# EAGLE design H15R00 (EAGLE 9.3.0)

## Sheet 1 of 2
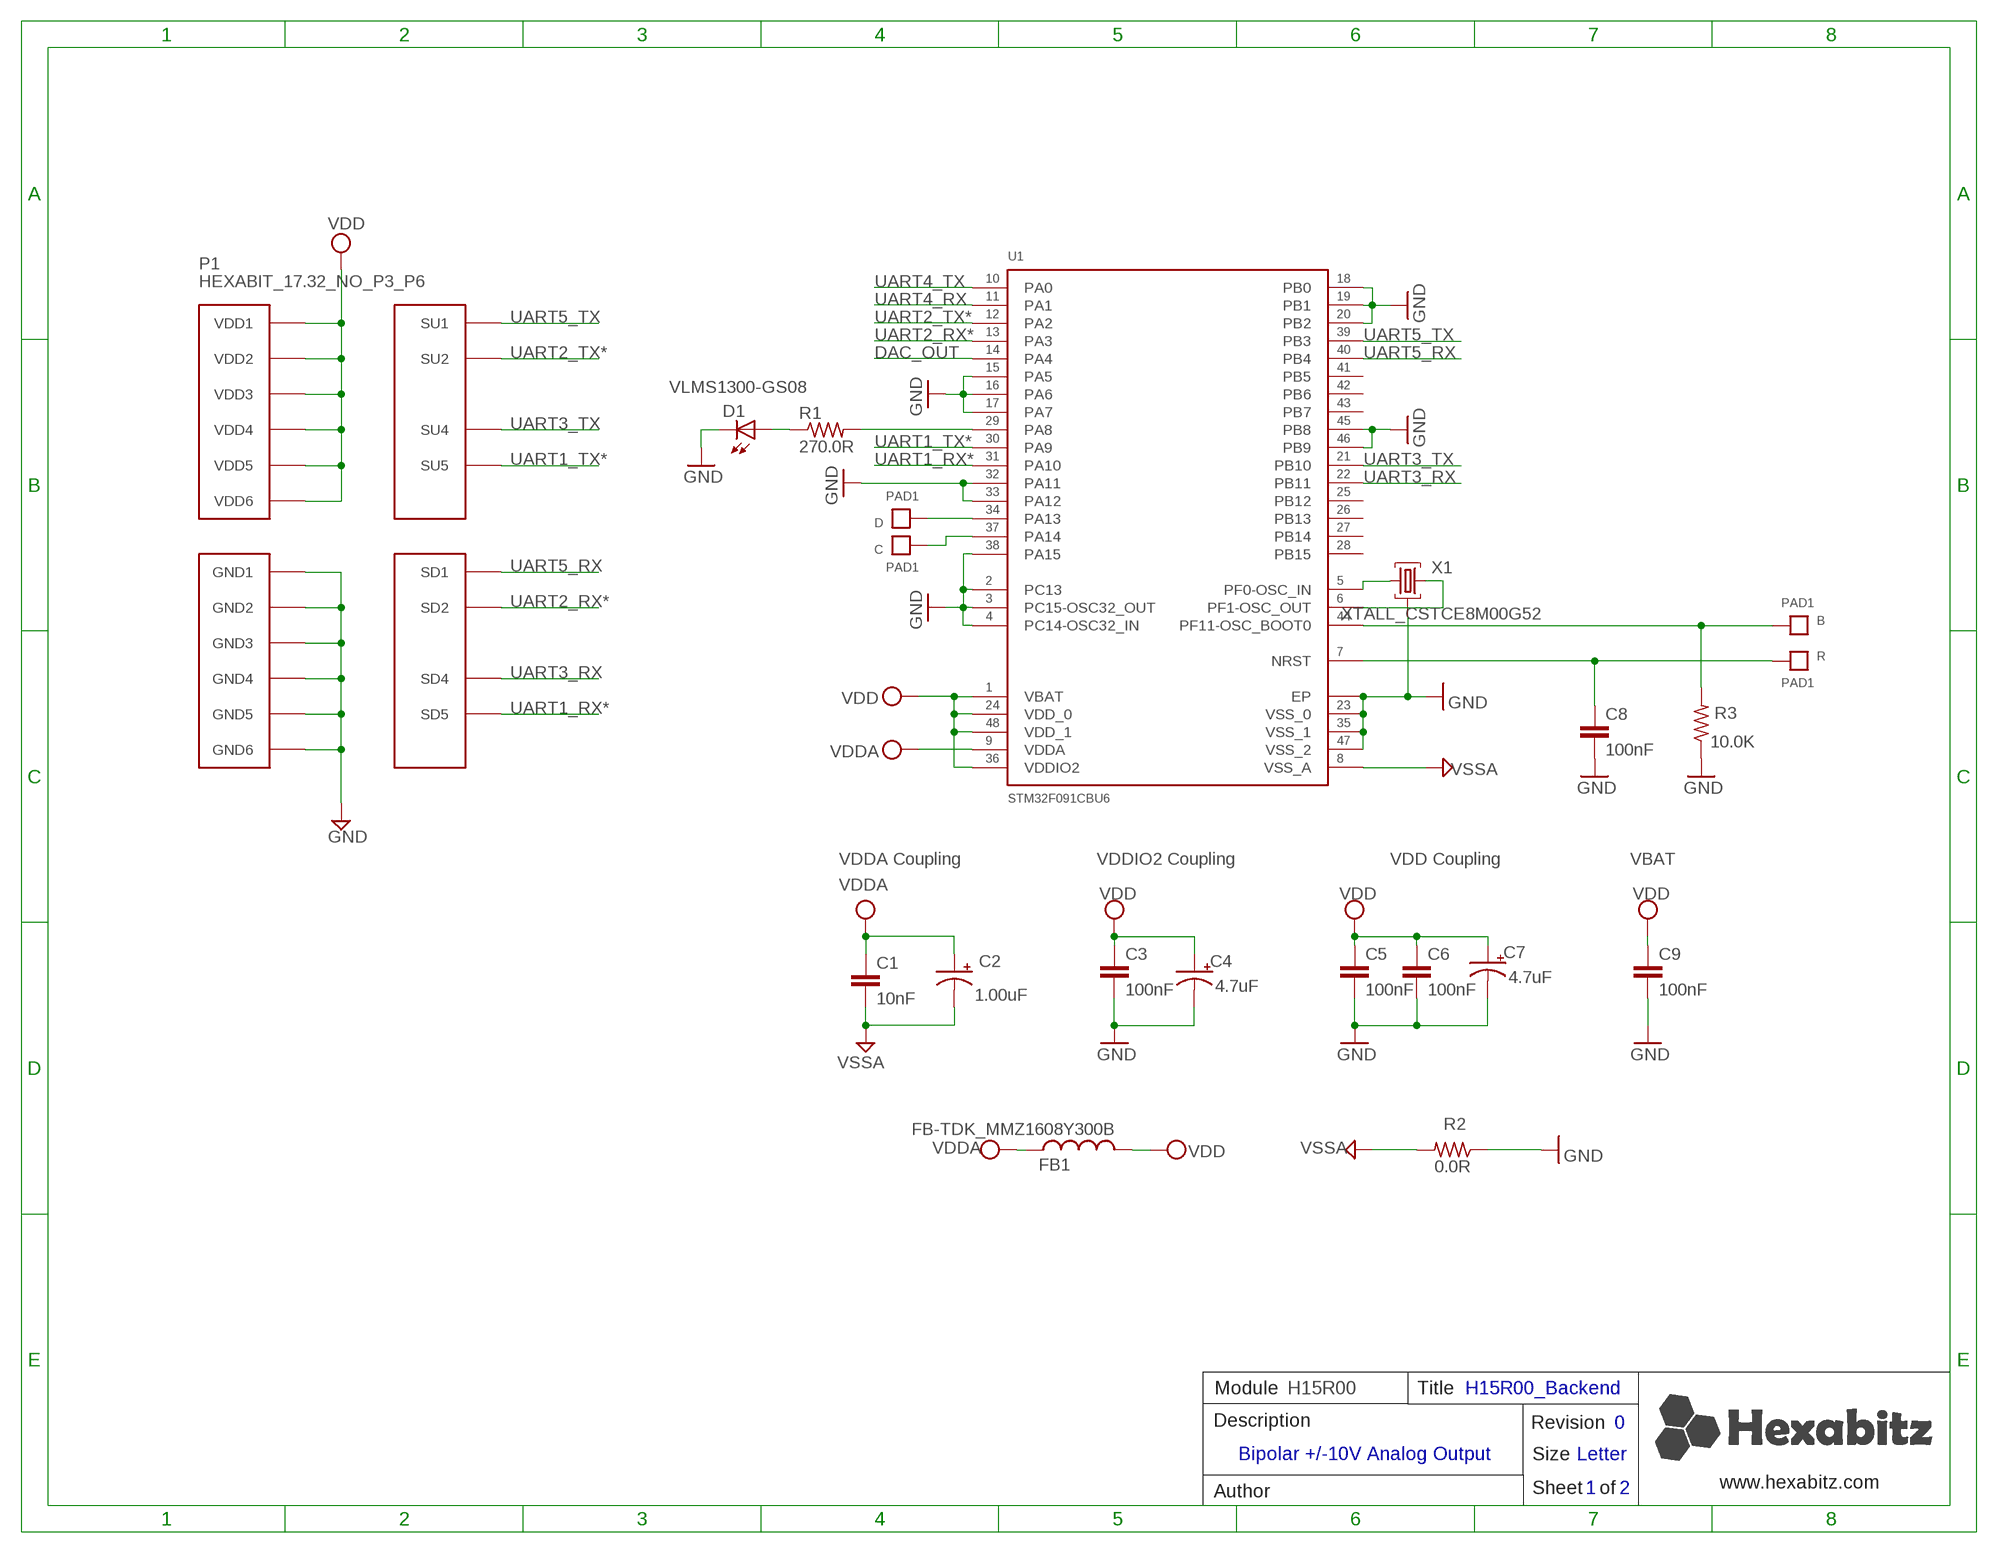
[diagram p0: schematic, sheet 1]

### Parts
B  PAD1  [PAD1]
C  PAD1  [PAD1]
C1  10nF  C-0603  [C-0603]
C2  1.00uF  C-0805-POL  [C-0805-POL]
C3  100nF  C-0603  [C-0603]
C4  4.7uF  C-0805-POL  [C-0805-POL]
C5  100nF  C-0603  [C-0603]
C6  100nF  C-0603  [C-0603]
C7  4.7uF  C-0805-POL  [C-0805-POL]
C8  100nF  C-0603  [C-0603]
C9  100nF  C-0603  [C-0603]
D  PAD1  [PAD1]
D1  VLMS1300-GS08  [VLMS1300-GS08]
FB1  FB-TDK_MMZ1608Y300B  [FB-TDK_MMZ1608Y300B]
P1  HEXABIT_17.32_NO_P3_P6  [HEXABIT_17.32_NO_P3_P6]
R  PAD1  [PAD1]
R1  270.0R  R-0603  [R-0603]
R2  0.0R  R-0603  [R-0603]
R3  10.0K  R-0603  [R-0603]
U1  STM32F091CBU6  [STM32F091CBU6]
X1  XTALL_CSTCE8M00G52  [XTALL_CSTCE8M00G52]

### Nets
B1: B.P$1 B.P$2 R3.2 U1.P$44(PF11-OSC_BOOT0)
DAC_OUT: U1.P$14(PA4) ; also sheet 2
GND: C3.2 C4.2(-) C5.2 C6.2 C7.2(-) C8.2 C9.2 D1.C P1.PAD_PD7(GND1) P1.PAD_PD8(GND2) P1.PAD_PD9(GND3) P1.PAD_PD10(GND4) P1.PAD_PD11(GND5) P1.PAD_PD12(GND6) R2.1 R3.1 U1.EP U1.P$2(PC13) U1.P$3(PC14-OSC32_IN) U1.P$4(PC15-OSC32_OUT) U1.P$15(PA5) U1.P$16(PA6) U1.P$17(PA7) U1.P$18(PB0) U1.P$19(PB1) U1.P$20(PB2) U1.P$23(VSS_0) U1.P$32(PA11) U1.P$33(PA12) U1.P$35(VSS_1) U1.P$38(PA15) U1.P$45(PB8) U1.P$46(PB9) U1.P$47(VSS_2) X1.P$2
N$3: R1.2 U1.P$29(PA8)
N$4: D1.A R1.1
N$5: U1.P$5(PF0-OSC_IN) X1.P$1
N$6: U1.P$6(PF1-OSC_OUT) X1.P$3
N$7: D.P$1 D.P$2 U1.P$34(PA13)
N$9: C.P$1 C.P$2 U1.P$37(PA14)
R1: C8.1 R.P$1 R.P$2 U1.P$7(NRST)
UART1_RX*: P1.PAD_PD5(SD5) U1.P$31(PA10)
UART1_TX*: P1.PAD_PU5(SU5) U1.P$30(PA9)
UART2_RX*: P1.PAD_PD2(SD2) U1.P$13(PA3)
UART2_TX*: P1.PAD_PU2(SU2) U1.P$12(PA2)
UART3_RX: P1.PAD_PD4(SD4) U1.P$22(PB11)
UART3_TX: P1.PAD_PU4(SU4) U1.P$21(PB10)
UART4_RX: U1.P$11(PA1)
UART4_TX: U1.P$10(PA0)
UART5_RX: P1.PAD_PD1(SD1) U1.P$40(PB4)
UART5_TX: P1.PAD_PU1(SU1) U1.P$39(PB3)
VDD: C3.1 C4.1(+) C5.1 C6.1 C7.1(+) C9.1 FB1.2 P1.PAD_PU7(VDD1) P1.PAD_PU8(VDD2) P1.PAD_PU9(VDD3) P1.PAD_PU10(VDD4) P1.PAD_PU11(VDD5) P1.PAD_PU12(VDD6) U1.P$1(VBAT) U1.P$24(VDD_0) U1.P$36(VDDIO2) U1.P$48(VDD_1)
VDDA: C1.1 C2.1(+) FB1.1 U1.P$9(VDDA) ; also sheet 2
VSSA: C1.2 C2.2(-) R2.2 U1.P$8(VSS_A) ; also sheet 2
Unconnected: U1.P$25(PB12) U1.P$26(PB13) U1.P$27(PB14) U1.P$28(PB15) U1.P$41(PB5) U1.P$42(PB6) U1.P$43(PB7)

### Notes on the sheet
- VDDA Coupling | VDDIO2 Coupling | VDD Coupling | VBAT
- Module | H15R00 | Title | H15R00_Backend
- Description | Revision | 0
- Bipolar +/-10V Analog Output
- Size | Letter
- www.hexabitz.com
- Author | Sheet   of | 1 | 2
- C:/Users/Admin/Desktop/logodraft.bmp

## Sheet 2 of 2
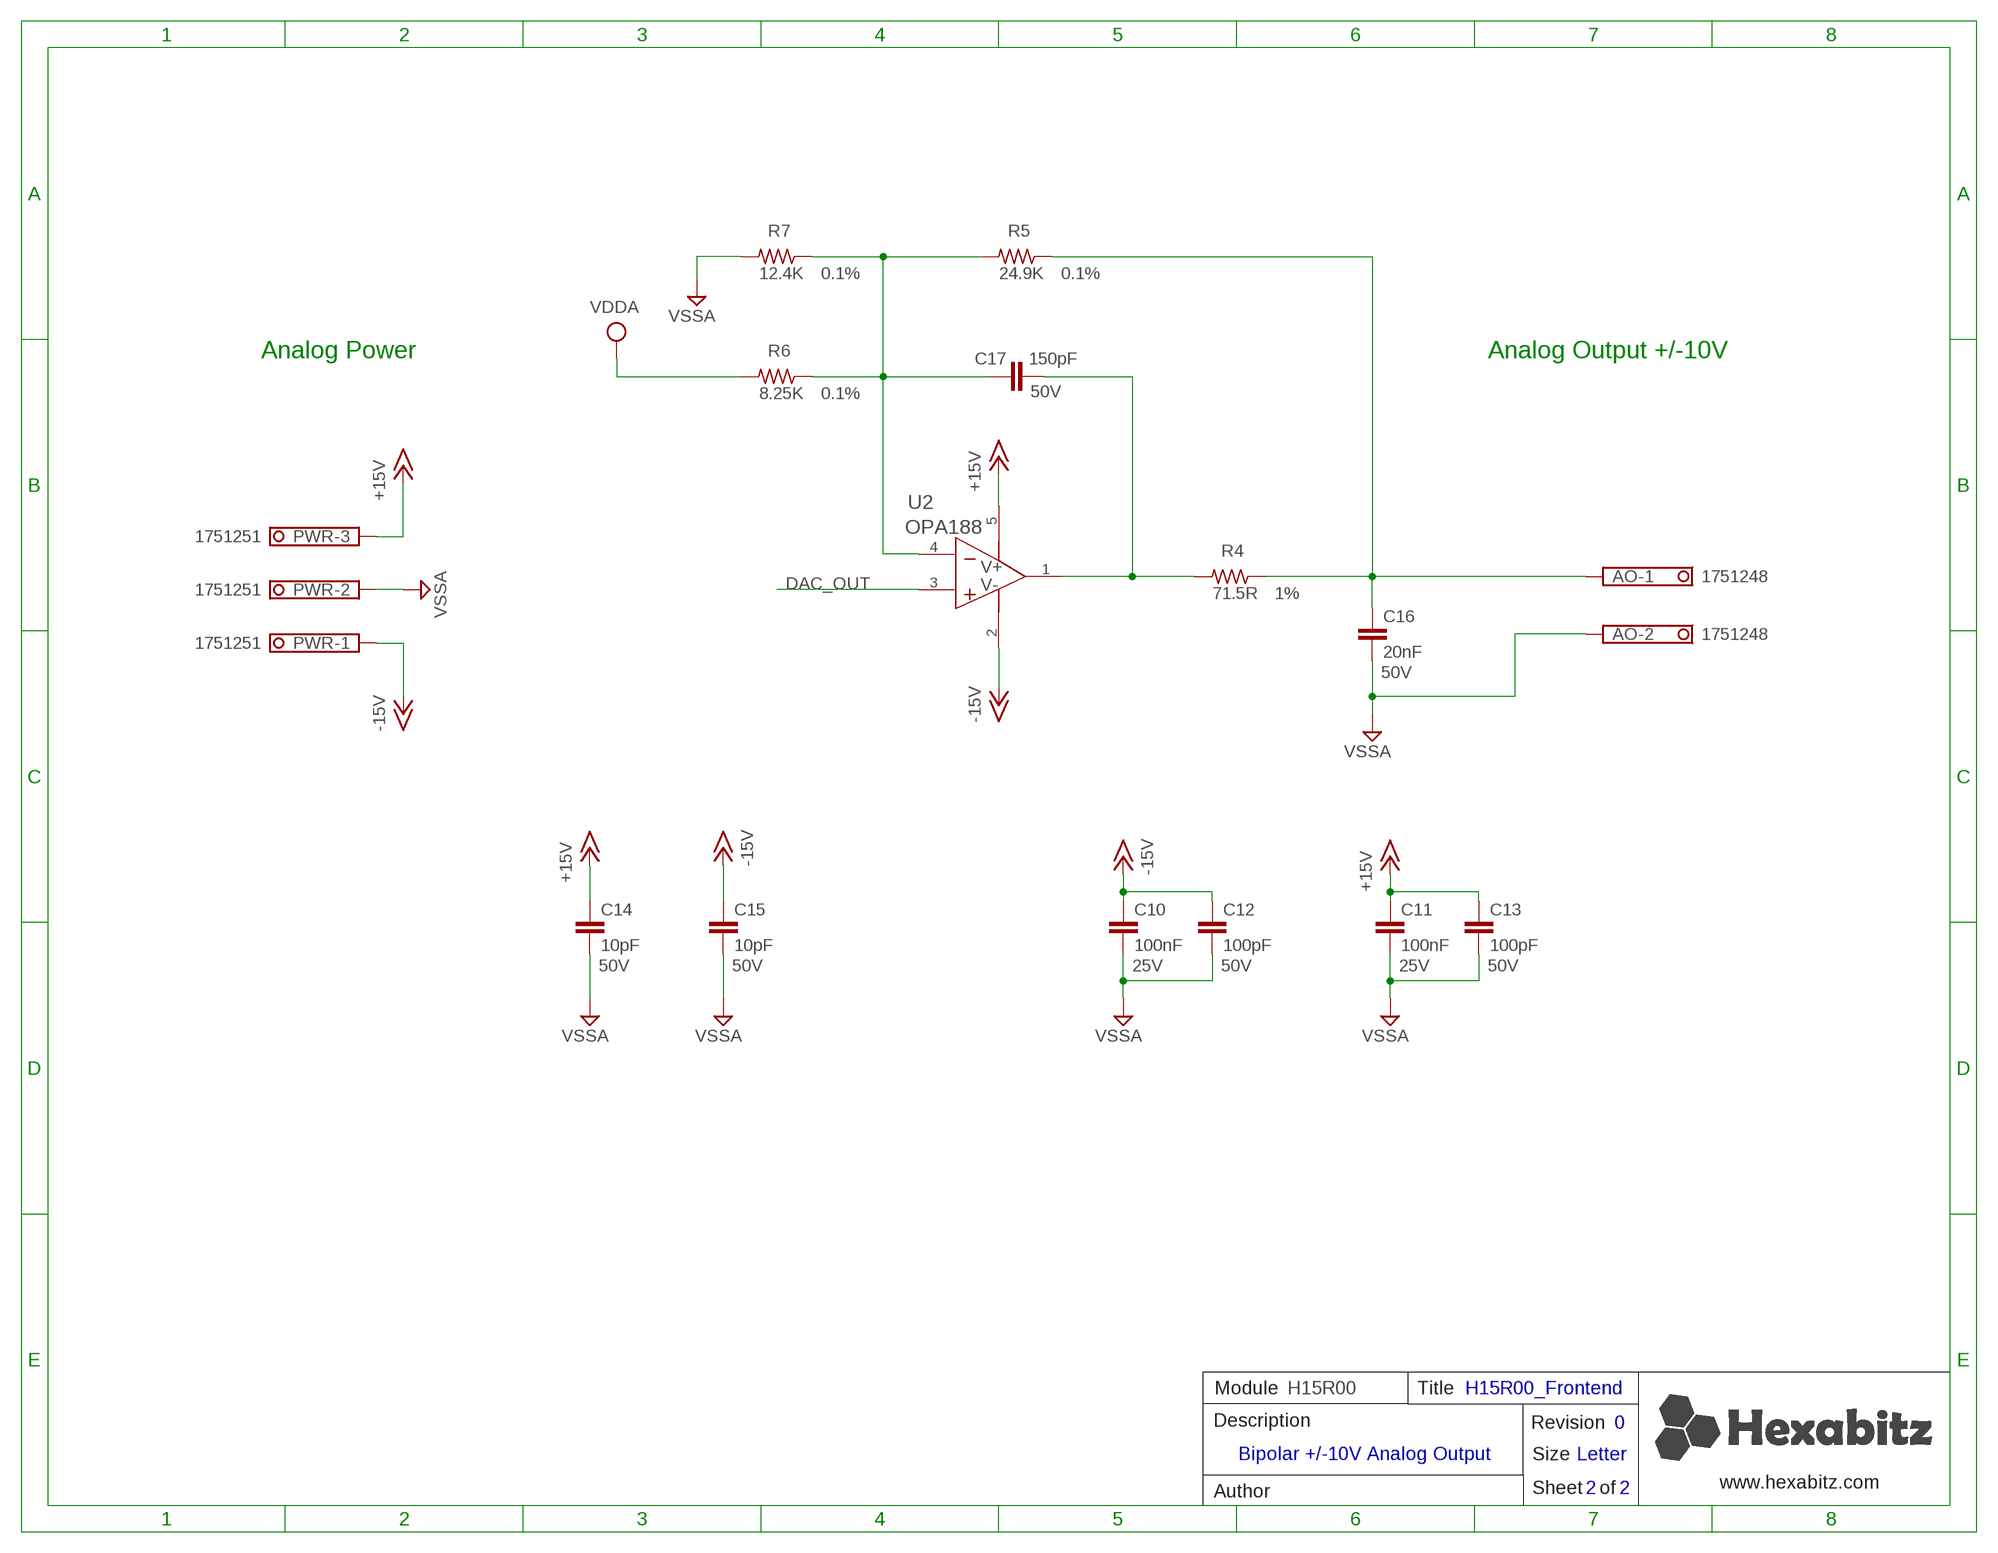
[diagram p1: schematic, sheet 2]

### Parts
AO  1751248  CON-PHOENIX-350_1751248  [CON-PHOENIX-350_1751248]
C10  100nF  C-0603  [C-0603]
C11  100nF  C-0603  [C-0603]
C12  100pF  C-0603  [C-0603]
C13  100pF  C-0603  [C-0603]
C14  10pF  C-0603  [C-0603]
C15  10pF  C-0603  [C-0603]
C16  20nF  C-0603  [C-0603]
C17  150pF  C-0603  [C-0603]
PWR  1751251  [1751251]
R4  71.5R  R-0603  [R-0603]
R5  24.9K  R-0603  [R-0603]
R6  8.25K  R-0603  [R-0603]
R7  12.4K  R-0603  [R-0603]
U2  OPA188  OPA188AIDBVR  [DBV0005A_N]

### Nets
+15V: C11.1 C13.1 C14.1 PWR.3 U2.5(V+)
-15V: C10.1 C12.1 C15.1 PWR.1 U2.2(V-)
DAC_OUT: U2.3(IN+) ; also sheet 1
N$1: AO.1 C16.1 R4.1 R5.1
N$2: C17.2 R4.2 U2.1(OUT)
N$8: C17.1 R5.2 R6.1 R7.1 U2.4(IN-)
VDDA: R6.2 ; also sheet 1
VSSA: AO.2 C10.2 C11.2 C12.2 C13.2 C14.2 C15.2 C16.2 PWR.2 R7.2 ; also sheet 1

### Notes on the sheet
- Analog Power | Analog Output +/-10V
- Module | H15R00 | Title | H15R00_Frontend
- Description | Revision | 0
- Bipolar +/-10V Analog Output
- Size | Letter
- www.hexabitz.com
- Author | Sheet   of | 2 | 2

## Library data of the parts
AO = Hexabitz:CON-PHOENIX-350_1751248: MKDS 1/ 2-3,5 Printklemme Nennstrom: 10 A Bemessungsspannung: 160 V Raster: 3,5 mm Polzahl: 2 Montageart: Löten Anschlussart: Schraubanschluss Anschlussrichtung vom Leiter zur Platine: 0° Source: http://eshop.phoenixcontact.com .. 1751248.pdf; MFN: Phoenix Contact; MPN: 1751248; OCTOPART_URL: https://octopart.com/1751248-phoenix+contact-31334?r=sp&s=dfbEyNHiQNetUL69ahOrPQ; OC_FARNELL: unknown; OC_NEWARK: unknown
B C D R = Hexabitz:PAD1
C1 = Hexabitz:C-0603: CAP CER 10% X7R 0603; CAPACITANCE: 10nF; MFN: KEMET; MPN: C0603C103K5RACTU; OCTOPART_URL: https://octopart.com/c0603c103k5ractu-kemet-133094?r=sp&s=R_iPBxLnSmGqhkU2rIMFpg; TOLERANCE: 10%; VOLTAGE_RATING: 50V
C2 = Hexabitz:C-0805-POL: Cap Tant Solid SMD 2012; CAPACITANCE: 1.00uF; MFN: Yageo; MPN: CC0805KKX7R7BB105; OCTOPART_URL: https://octopart.com/cc0805kkx7r7bb105-yageo-8376555?r=sp&s=YKl1wwtkROau_X5nniH2ig; TOLERANCE: 10%; VOLTAGE_RATING: 16V
C3 C6 C8 = Hexabitz:C-0603: CAP CER 10% X7R 0603; CAPACITANCE: 100nF; MFN: KEMET; MPN: C0603C104K8RACTU; OCTOPART_URL: https://octopart.com/c0603c104k8ractu-kemet-145075?r=sp&s=9bS9ASSwSEqMCE9KBEQZ0g; TOLERANCE: 10%; VOLTAGE_RATING: 10V
C4 C7 = Hexabitz:C-0805-POL: Cap Tant Solid SMD 2012; CAPACITANCE: 4.7uF; MFN: Murata; MPN: GRM21BC81E475KA12L; OCTOPART_URL: https://octopart.com/grm21bc81e475ka12l-murata-10331911?r=sp&s=RY3qZSD8T6mG6TC9CHI5qQ; TOLERANCE: 10%; VOLTAGE_RATING: 25V
C5 = Hexabitz:C-0603: CAP CER 10% X7R 0603; CAPACITANCE: 100nF; MFN: KEMET; MPN: C0603C104K8RACTU; OCTOPART_URL: https://octopart.com/c0603c104k8ractu-kemet-145075?r=sp&s=9bS9ASSwSEqMCE9KBEQZ0g; TOLERANCE: 10%; VOLTAGE_RATING: 10
C9 = Hexabitz:C-0603: CAP CER 10% X7R 0603; CAPACITANCE: 100nF; MFN: KEMET; MPN: C0603C104K8RACTU; OCTOPART_URL: https://octopart.com/c0603c104k8ractu-kemet-145075?r=sp&s=9bS9ASSwSEqMCE9KBEQZ0g; TOLERANCE: 10V; VOLTAGE_RATING: 10%
C10 C11 = Hexabitz:C-0603: CAP CER 10% X7R 0603; CAPACITANCE: 100nF; MFN: Murata; MPN: GRM188R71E104KA01D; OCTOPART_URL: https://octopart.com/grm188r71e104ka01d-murata-196239?r=sp&s=9Sa0iYM-THq9pjXKXbxryA; TOLERANCE: 10%; VOLTAGE_RATING: 25V
C12 C13 = Hexabitz:C-0603: CAP CER 10% X7R 0603; CAPACITANCE: 100pF; MFN: Avx; MPN: 06035A101JAT2A; OCTOPART_URL: https://octopart.com/06035a101jat2a-avx-55386344?r=sp&s=OWJQ2Zm8S2q0g8RSQtFoSw; TOLERANCE: 5%; VOLTAGE_RATING: 50V
C14 C15 = Hexabitz:C-0603: CAP CER 10% X7R 0603; CAPACITANCE: 10pF; MFN: Murata; MPN: GRM1885C1H100JA01D; OCTOPART_URL: https://octopart.com/grm1885c1h100ja01d-murata-196121?r=sp&s=M0doikvzQymn4ajEe0ihSw; TOLERANCE: 5%; VOLTAGE_RATING: 50V
C16 = Hexabitz:C-0603: CAP CER 10% X7R 0603; CAPACITANCE: 20nF; MFN: Samsung; MPN: CL10B203KB8NNNC; OCTOPART_URL: https://octopart.com/cl10b203kb8nnnc-samsung-19831635?r=sp&s=OBY_pk9VR_mJ3Hxg4Ft1_g; TOLERANCE: 10%; VOLTAGE_RATING: 50V
C17 = Hexabitz:C-0603: CAP CER 10% X7R 0603; CAPACITANCE: 150pF; MFN: TDK; MPN: C1608C0G1H151F080AA; OCTOPART_URL: https://octopart.com/c1608c0g1h151f080aa-tdk-26013419?r=sp&s=gUiTfpbJT1mAyA8NJ0XI8Q; TOLERANCE: 1%; VOLTAGE_RATING: 50V
D1 = Hexabitz:VLMS1300-GS08: Red 0603 130° Clear 54 mcd 2 V Surface Mount ChipLED ; Octopart Url : http://octopart.com/vlms1300-gs08-vishay-21709201; MFN: Vishay; MPN: VLMS1300-GS08; OCTOPART_URL: https://octopart.com/vlms1300-gs08-vishay-21709201?r=sp&s=_gcP4_q8T1SC6PJQPTQ9yA
FB1 = Hexabitz:FB-TDK_MMZ1608Y300B: Ferrite Beads Multi-Layer 30Ohm 25% 100MHz 1.5A 50mOhm DCR 0603; MFN: TDK; MPN: MMZ1608Y300B; OCTOPART_URL: https://octopart.com/mmz1608y300b-tdk-368280?r=sp&s=cd9_2ZEqQ9q9UNBuQgHAiA
P1 = hexabitz_connectors:HEXABIT_?_NO_P3_P6: Hexabitz Hexagon Module Connector Hexagon side length = 17.32mm. The following ports are removed: P3 P6
PWR = con-phoenix-350:1751251: MKDS 1/ 3-3,5 Printklemme Nennstrom: 10 A Bemessungsspannung: 160 V Raster: 3,5 mm Polzahl: 3 Montageart: Löten Anschlussart: Schraubanschluss Anschlussrichtung vom Leiter zur Platine: 0° Source: http://eshop.phoenixcontact.com .. 1751251.pdf; MFN: Phoenix Contact; MPN: 1751251; OCTOPART_URL: https://octopart.com/1751251-phoenix+contact-36473?r=sp&s=9M0VWNoHTyq04j3qI6lQOQ; OC_FARNELL: unknown; OC_NEWARK: unknown
R1 = Hexabitz:R-0603: Thick Film Resistors - SMD 0603; MFN: Yageo; MPN: RC0603FR-07270RL; OCTOPART_URL: https://octopart.com/search?q=RC0603FR-07270RL&start=0; RESISTANCE: 270.0 Ohm; TOLERANCE: 1%
R2 = Hexabitz:R-0603: Thick Film Resistors - SMD 0603; MFN: Yageo; MPN: RC0603JR-070RL; OCTOPART_URL: https://octopart.com/rc0603jr-070rl-yageo-1241539?r=sp&s=X2NteqRjRNWrnx42Y0aliA; RESISTANCE: 0.0 Ohm
R3 = Hexabitz:R-0603: Thick Film Resistors - SMD 0603; MFN: Yageo; MPN: RC0603JR-0710KL; OCTOPART_URL: https://octopart.com/search?q=RC0603JR-0710KL&start=0; RESISTANCE: 10.0K Ohm; TOLERANCE: 5%
R4 = Hexabitz:R-0603: Thick Film Resistors - SMD 0603; MFN: Panasonic; MPN: ERJ-3EKF71R5V; OCTOPART_URL: https://octopart.com/erj-3ekf71r5v-panasonic-55421901?r=sp&s=JXFkVIq0Td2PcEUj2-UrKA; RESISTANCE: 71.5 Ohm; TOLERANCE: 1%
R5 = Hexabitz:R-0603: Thick Film Resistors - SMD 0603; MFN: Panasonic; MPN: ERA-3AEB2492V; OCTOPART_URL: https://octopart.com/era-3aeb2492v-panasonic-14412272?r=sp&s=tIguNO2DQ02PU7gq6_vEIQ; RESISTANCE: 24.9 kOhm; TOLERANCE: 0.1%
R6 = Hexabitz:R-0603: Thick Film Resistors - SMD 0603; MFN: Panasonic; MPN: ERA-3AEB8251V; OCTOPART_URL: https://octopart.com/era-3aeb8251v-panasonic-55477301?r=sp&s=p46abNa6QO-wGnrush-PUA; RESISTANCE: 8.25 kOhm; TOLERANCE: 0.1%
R7 = Hexabitz:R-0603: Thick Film Resistors - SMD 0603; MFN: Panasonic; MPN: ERA-3AEB1242V; OCTOPART_URL: https://octopart.com/era-3aeb1242v-panasonic-55639351?r=sp&s=K0xQjqOwSGaT1tqbXnh0hg; RESISTANCE: 12.4 kOhm; TOLERANCE: 0.1%
U1 = Hexabitz:STM32F091CBU6: Description : ARM-based 32-bit MCU, CAN, 12 timers, ADC, DAC & Comm. Interface, 2 to 3.6 V, -40 to 85 degC, 48-Pin UFQFPN, RoHS, Tray ;Parameter : Ciiva URL : https://ciiva.com/part/STM32F091CBU6-20240708, CiivaID : 20240708, Clock Speed : 48000000.0 Hz, Lifecycle Status : Active, Mounting Style : Surface Mount, Number of Pins : 48, Octopart Url : https://octopart.com/stm32f091cbu6-stmicroelectronics-51988677, OctopartID : 5f4f955c32ec8088, RAM Memory Size : 32768 B, REACH SVHC Compliance : No SVHC, RoHS : Compliant,; MFN: STMicroelectronics; MPN: STM32F091CBU6; OCTOPART_URL: https://octopart.com/stm32f091cbu6-stmicroelectronics-51988677?r=sp&s=bU6fpgsrTZOxHyt7jkfh3w
U2 = Hexabitz:OPA188AIDBVR; ALTERNATE_PARTNUMBER: OPA188AIDBVT; APPLICATION_BUILDNUMBER: *; COMPTYPE: IC; MANUFACTURER: Texas Instruments; MFN: Texas Instruments; MOUNTTYPE: SMT; MPN: OPA188AIDBVR; OCTOPART_URL: https://octopart.com/opa188aidbvr-texas+instruments-27810397?r=sp&s=zwpAzK6tSwu39ID1-8lLKg; PACKAGEREFERENCE: DBV0005A; PARTNUMBER: OPA188AIDBVR; PIN_COUNT: 5; REFDES: RefDes; ROHS: Y; TYPE: TYPE
X1 = Hexabitz:XTALL_CSTCE8M00G52: MURATA CSTCE8M00G52-R0 RESONATOR, SMD, 8MHZ ; Octopart Url : https://octopart.com/cstce8m00g52-r0-murata-7145559; MFN: Murata; MPN: CSTCE8M00G52Z-R0; OCTOPART_URL: https://octopart.com/cstce8m00g52z-r0-murata-17755941?r=sp&s=JDnNJnrHQhyS8Zk4ofFWXw

## Board
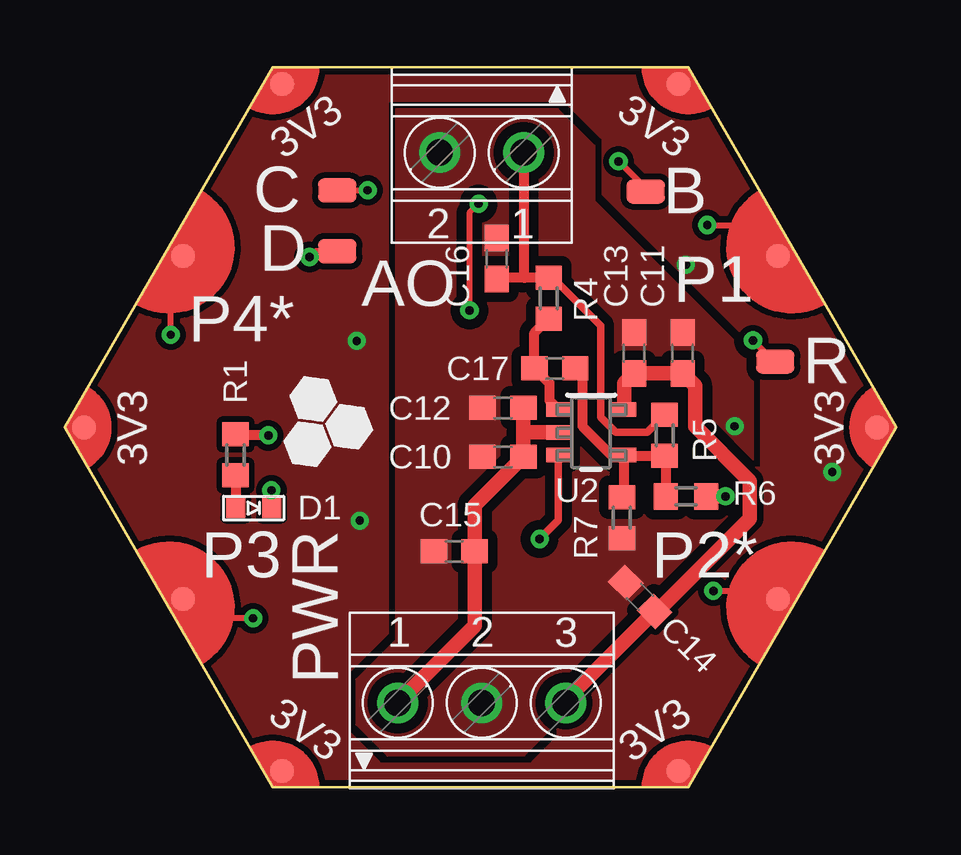
[diagram p2: board, top side]
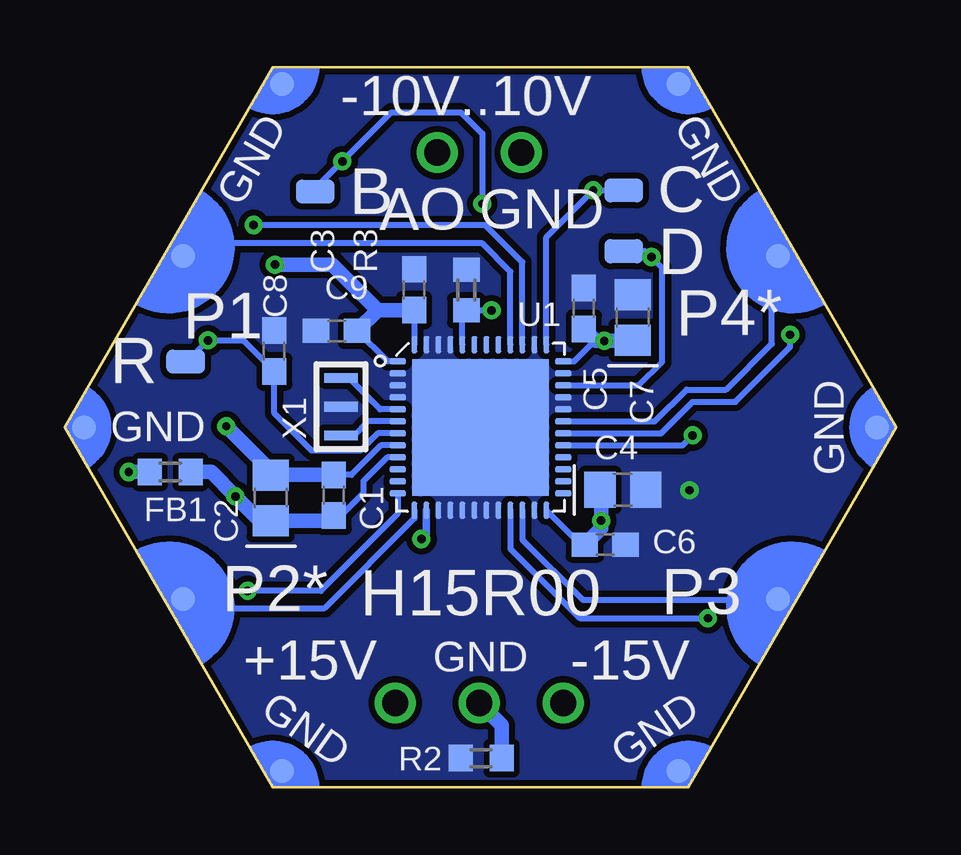
[diagram p3: board, bottom side, seen from below]

Size 34.64 x 30 mm. Coordinates in mm from the lower left corner, seen from the top.
Copper layers (1*16): Top 0.035mm / dielectric 1.5mm / Bottom 0.035mm
Design rules "2_layer": minimum track width 7mil, minimum drill 10mil, track to track 6mil, track to pad 6mil, pad to pad 6mil, via to via 6mil, smd to smd 0mil, copper to edge 1mil, drill to drill 8mil, minimum pad ring 10mil, minimum via ring 8mil, stop-mask expansion 2mil, vias tented up to drill 15mil, thermal gap 10mil

### Footprints (pad centres in the part's own frame; a part is rotated, then mirrored left to right if it is on the bottom)
CON-PHOENIX-350_1751248 = drill 1.1 pad 1.7: 1 -1.75,-0.1; 2 1.75,-0.1
PAD1 = smd 1.6 x 1: P$1 0,0 | smd 1.6 x 1 bottom: P$2 0,0
C-0603 = smd 1.1 x 1: 1 -0.85,0; 2 0.85,0
C-0805-POL = smd 1.3 x 1.5: 1 -0.95,0; 2 0.95,0
VLMS1300-GS08 = smd 0.8 x 0.8: A 0,0.75; C 0,-0.75
FB-TDK_MMZ1608Y300B = smd 1 x 1.1: 1 -0.85,0; 2 0.85,0
HEXABIT_17.32_NO_P3_P6 = smd 1 x 1 bottom: PAD_PD1 12.39,7.15; PAD_PD2 12.39,-7.15; PAD_PD4 -12.39,-7.15; PAD_PD5 -12.39,7.15; PAD_PD7 8.26,14.31; PAD_PD8 16.52,0; PAD_PD9 8.26,-14.31; PAD_PD10 -8.26,-14.31; PAD_PD11 -16.52,0; PAD_PD12 -8.26,14.31 | smd 1 x 1: PAD_PU1 12.39,7.15; PAD_PU2 12.39,-7.15; PAD_PU4 -12.39,-7.15; PAD_PU5 -12.39,7.15; PAD_PU7 8.26,14.31; PAD_PU8 16.52,0; PAD_PU9 8.26,-14.31; PAD_PU10 -8.26,-14.31; PAD_PU11 -16.52,0; PAD_PU12 -8.26,14.31
1751251 = drill 1.1 pad 1.7: 1 -3.5,-0.1; 2 0,-0.1; 3 3.5,-0.1
R-0603 = smd 1 x 1.1: 1 -0.85,0; 2 0.85,0
STM32F091CBU6 = smd 5.7 x 5.7: EP 0,0 | smd 0.25 x 0.7: P$1 -2.75,-3.45; P$2 -2.25,-3.45; P$3 -1.75,-3.45; P$4 -1.25,-3.45; P$5 -0.75,-3.45; P$6 -0.25,-3.45; P$7 0.25,-3.45; P$8 0.75,-3.45; P$9 1.25,-3.45; P$10 1.75,-3.45; P$11 2.25,-3.45; P$12 2.75,-3.45; P$25 2.75,3.45; P$26 2.25,3.45; P$27 1.75,3.45; P$28 1.25,3.45; P$29 0.75,3.45; P$30 0.25,3.45; P$31 -0.25,3.45; P$32 -0.75,3.45; P$33 -1.25,3.45; P$34 -1.75,3.45; P$35 -2.25,3.45; P$36 -2.75,3.45 | smd 0.7 x 0.25: P$13 3.45,-2.75; P$14 3.45,-2.25; P$15 3.45,-1.75; P$16 3.45,-1.25; P$17 3.45,-0.75; P$18 3.45,-0.25; P$19 3.45,0.25; P$20 3.45,0.75; P$21 3.45,1.25; P$22 3.45,1.75; P$23 3.45,2.25; P$24 3.45,2.75; P$37 -3.45,2.75; P$38 -3.45,2.25; P$39 -3.45,1.75; P$40 -3.45,1.25; P$41 -3.45,0.75; P$42 -3.45,0.25; P$43 -3.45,-0.25; P$44 -3.45,-0.75; P$45 -3.45,-1.25; P$46 -3.45,-1.75; P$47 -3.45,-2.25; P$48 -3.45,-2.75
DBV0005A_N = smd 1 x 0.6: 1 -1.375,0.95; 2 -1.375,0; 3 -1.375,-0.95; 4 1.375,-0.95; 5 1.375,0.95
XTALL_CSTCE8M00G52 = smd 1.4 x 0.4: P$1 0,1.2; P$2 0,0; P$3 0,-1.2

### Placement (x,y rotation side)
AO  17.37,26.35 180 top
B  24.2,24.83 0 top
C  11.35,24.88 0 top
C1  23.43,12.17 90 bottom
C2  26.06,12.06 90 bottom
C3  20.09,20.74 90 bottom
C4  11.39,12.4 0 bottom
C5  13.01,19.96 90 bottom
C6  12.12,10.12 0 bottom
C7  10.98,19.58 90 bottom
C8  25.91,18.18 90 bottom
C9  23.32,19.03 180 bottom
C10  18.26,13.78 180 top
C11  25.75,18.1 90 top
C12  18.26,15.81 180 top
C13  23.72,18.1 90 top
C14  23.97,7.94 135 top
C15  16.23,9.84 180 top
C16  18.01,22.04 90 top
C17  20.42,17.46 180 top
D  11.35,22.34 180 top
D1  7.87,11.64 90 top
FB1  30.25,13.14 180 bottom
P1  17.32,15 0 top
PWR  17.37,3.62 0 top
R  29.6,17.74 0 top
R1  7.11,13.86 90 top
R2  17.29,1.22 0 bottom
R3  17.91,20.73 270 bottom
R4  20.16,20.38 270 top
R5  24.99,14.67 270 top
R6  25.88,12.13 0 top
R7  23.21,11.24 270 top
U1  17.32,15 270 bottom
U2  21.94,14.8 0 top
X1  23.13,15.86 0 bottom

### Tracks (layer width: path | path; a pad name or v marks a point on that pad's centre or on a via)
+15V
  Top 0.61: U2.5 23.32,16.85 C13.1 C11.1 26.26,16.74 26.26,15.05 28.55,12.76 28.55,11.2 24.69,7.34 C14.1 20.87,3.63 PWR.3
-15V
  Top 0.61: C12.1 19.11,14.8 | 19.11,14.8 C10.1 17.08,11.75 C15.1 17.08,6.73 PWR.1 | U2.2 19.11,14.8
B1  (via drill 0.35)
  Top 0.254: v16.86,19.88 16.86,23.94 v17.24,24.32 | v23.07,26.09 24.2,24.96 B.P$1
  Bottom 0.254: U1.P$44 18.07,19.72 R3.2 v16.86,19.88 | B.P$1 24.2,24.96 v23.07,26.09 21.03,28.13 18.13,28.13 17.24,27.24 v17.24,24.32 | v16.86,19.88
DAC_OUT  (via drill 0.35)
  Top 0.305: U2.3 20.57,11.14 v19.78,10.35
  Bottom 0.305: v19.78,10.35 19.57,10.57 U1.P$14
GND  (via drill 0.35)
  Top 0.406: D1.C 8.62,12.37 v8.61,12.38
  pour Bottom (isolate 0.254, no thermals): 8.66,0 25.98,0 34.64,15 25.98,30 8.66,30 0,15
N$1
  Top 0.305: R5.1 24.27,14.8 22.96,14.8 22.32,15.43 22.32,19.24 20.33,21.23 R4.1
  Top 0.406: R4.1 19.15,21.23 | 19.15,21.23 18.13,21.23 C16.1 | AO.1 19.12,21.26 19.15,21.23
N$2
  Top 0.406: U2.1 20.19,16.13 20.19,16.85 C17.2 19.57,18.94 R4.2
N$3  (via drill 0.35)
  Top 0.406: v8.48,14.67 7.15,14.67 R1.2
  Bottom 0.254: U1.P$29 8.9,14.25 v8.48,14.67
N$4
  Top 0.406: R1.1 D1.A
N$5
  Bottom 0.254: U1.P$5 21.5,15.75 22.81,17.06 X1.P$1
N$6
  Bottom 0.254: U1.P$6 22,15.25 22.59,14.66 X1.P$3
N$7  (via drill 0.35)
  Top 0.254: D.P$1 10.44,22.34 v10.19,22.1
  Bottom 0.254: U1.P$34 10.72,16.75 9.75,17.72 9.75,21.65 v10.19,22.1 10.44,22.34 D.P$1
N$8
  Top 0.406: U2.4 23.34,13.82 R5.2 25.03,13.78 R6.1 | R7.1 23.32,12.2 U2.4 | C17.1 21.56,17.17 21.56,15.05 22.77,13.85 U2.4
N$9  (via drill 0.35)
  Top 0.254: C.P$1 v12.62,24.88
  Bottom 0.254: U1.P$37 14.57,22.93 v12.62,24.88 C.P$1
R1  (via drill 0.35)
  Top 0.254: R.P$1 29.56,17.74 v28.67,18.63
  Bottom 0.254: U1.P$7 21.61,14.75 22.32,14.03 24.36,14.03 25.91,15.59 C8.1 27.2,18.63 v28.67,18.63 29.56,17.74 R.P$1
UART1_RX*
  Bottom 0.254: U1.P$31 10.06,15.25 8.73,16.57 7.08,16.57 5.18,18.48 5.18,21.9 P1.PAD_PD5
UART1_TX*  (via drill 0.35)
  Top 0.254: v4.42,18.86 4.42,21.64 P1.PAD_PU5
  Bottom 0.254: U1.P$30 9.8,14.75 8.48,16.07 6.7,16.07 4.42,18.35 v4.42,18.86
UART2_RX*
  Bottom 0.254: U1.P$13 20.07,11.21 23.81,7.47 29.33,7.47 P1.PAD_PD2
UART2_TX*  (via drill 0.35)
  Top 0.254: v27.02,8.19 29.37,8.19 P1.PAD_PU2
  Bottom 0.254: U1.P$12 20.77,11.4 23.97,8.19 v27.02,8.19
UART3_RX
  Bottom 0.254: U1.P$22 15.57,10.33 13.05,7.81 4.97,7.81 P1.PAD_PD4
UART3_TX  (via drill 0.35)
  Top 0.254: v7.85,7.05 5.73,7.05 P1.PAD_PU4
  Bottom 0.254: U1.P$21 16.07,9.94 13.18,7.05 v7.85,7.05
UART5_RX
  Bottom 0.254: U1.P$40 16.07,21.5 17.24,22.67 29.19,22.67 P1.PAD_PD1
UART5_TX  (via drill 0.35)
  Top 0.254: v26.77,23.43 28.43,23.43 P1.PAD_PU1
  Bottom 0.254: U1.P$39 15.57,21.89 17.12,23.43 v26.77,23.43
VDD  (via drill 0.35)
  Bottom 0.254: C3.1 20.07,19.87 U1.P$48 | U1.P$1 21.19,17.75 C9.1 | U1.P$24 13.14,10.12 C6.1 | U1.P$36 13.42,17.75 12.54,18.63
  Bottom 0.61: C3.1 21.6,19.89 | 21.6,19.89 C9.1 | FB1.2 v31.98,13.15 | 12.54,18.63 C5.1 12.51,18.61 v12.16,18.61 11,18.61 C7.1 | 21.6,19.89 23.49,21.78 v25.88,21.78 | C6.1 12.29,10.8 v12.29,11.11 12.29,12.36 C4.1
  pour Top (isolate 0.254, rank 2, no thermals): 8.66,0 25.98,0 34.64,15 25.98,30 8.66,30 0,15
VDDA  (via drill 0.35)
  Top 0.61: R6.2 v27.53,12.13
  Bottom 0.254: U1.P$9 21.21,13.75 22.2,12.76 22.2,12.26 23.13,11.32 C1.1
  Bottom 0.61: C1.1 23.64,11.11 C2.1 26.51,11.11 v27.53,12.13 28.54,13.14 FB1.1
VSSA  (via drill 0.35)
  Bottom 0.254: U1.P$8 21.47,14.25 22.7,13.02 C1.2
  Bottom 0.61: R2.2 16.44,2.59 PWR.2 | C1.2 26.05,13.02 C2.2 26.06,13.2 v27.91,15.05
  pour Top (isolate 0.406, no thermals): 13.81,28.26 20.55,28.26 22.07,26.73 22.07,24.45 28.67,17.84 28.67,10.86 19.15,1.33 13.43,1.33 12.16,2.6 12.16,4.51 13.81,6.16

### Text on the board
tPlace: 3V3 | 3V3 | P1 | P4* | 3V3 | 3V3 | P3 | P2* | 3V3 | 3V3
bPlace: -10V..10V | GND | GND | GND | AO | P4* | P1 | GND | GND | P3 | H15R00 | P2* | -15V | GND | +15V | GND | GND
bNames: C | B | D | R